# EasyEDA schematic SCH_SmartBluetoothScanner_2022-03-12.json
TITLE: Sheet_1; REV: 1.0; Date: 2022-03-12; Sheet: 1/1; Drawn By: naumanshakir; Company: Your Company
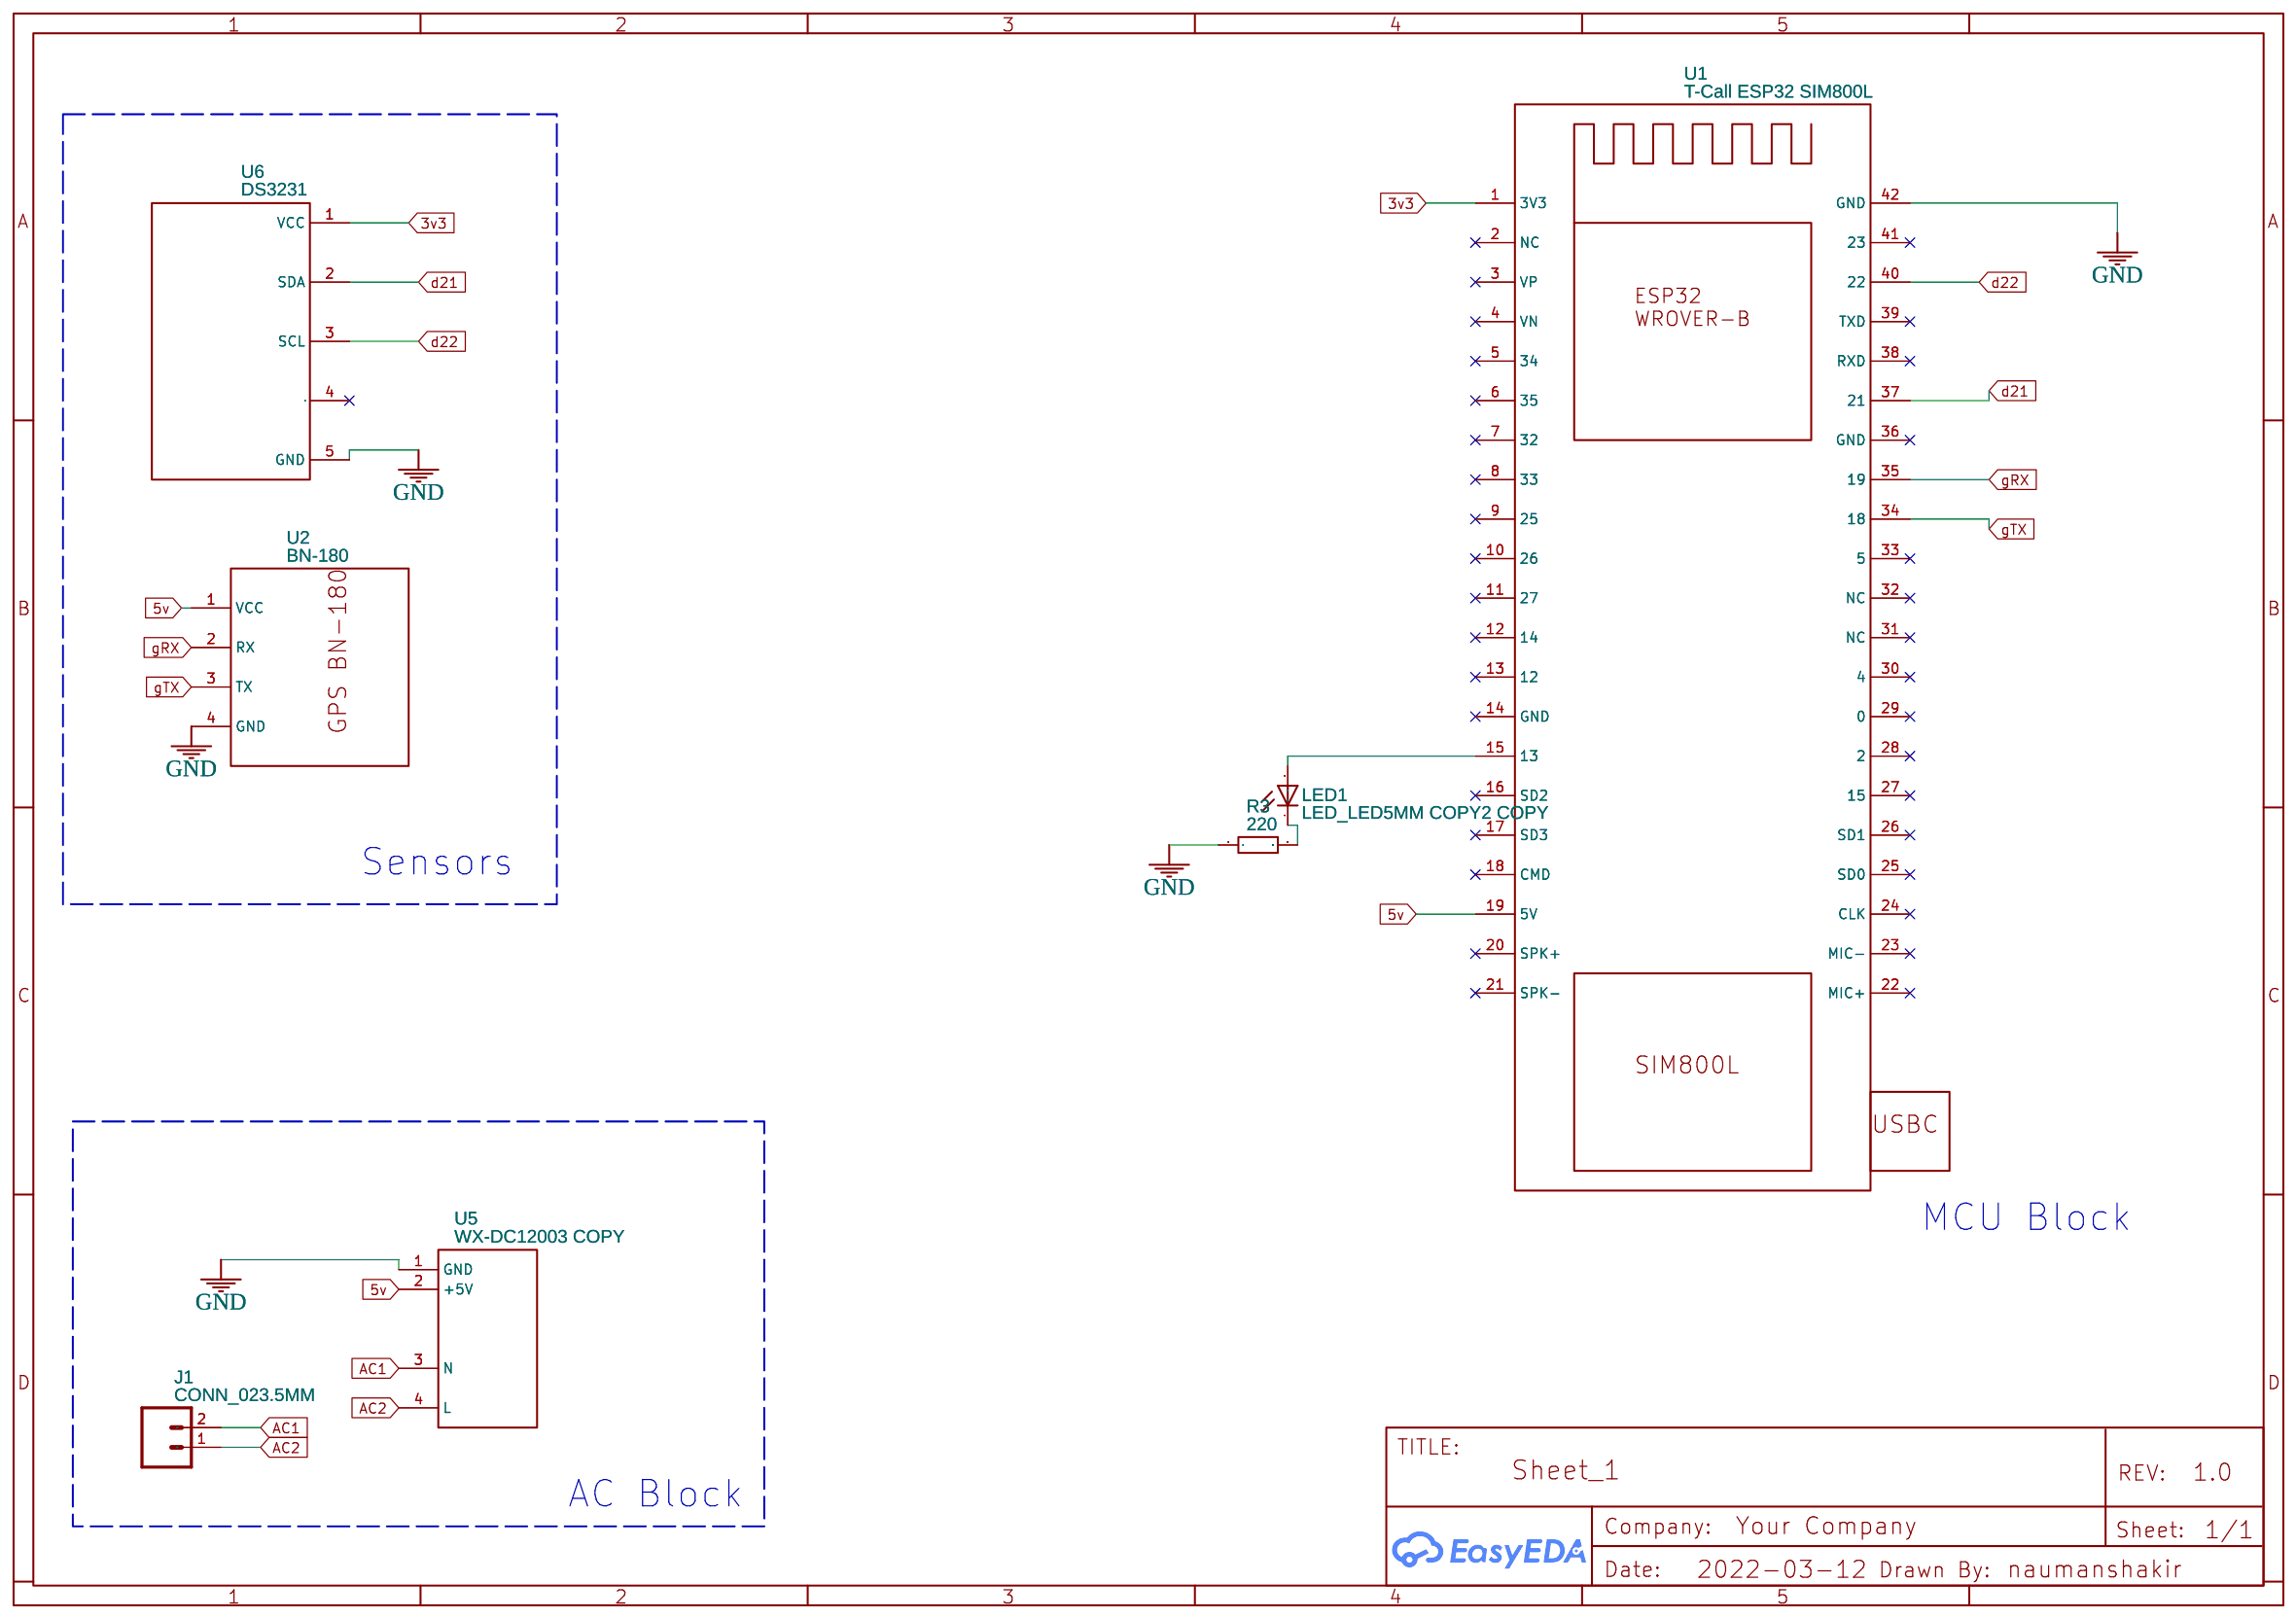
[diagram p0: schematic sheet]

## Parts
J1  CONN_023.5MM  [SCREWTERMINAL-3.5MM-2]
LED1  LED_LED5MM COPY2 COPY  [LED_LED5MM]
R3  220  [RES-TH_BD3.3-L9.0-P13.00-D0.6]
U1  T-Call ESP32 SIM800L  [T-CALL ESP32 SIM800L]
U2  BN-180  [GPS BN-180 BEITIAN]
U5  WX-DC12003 COPY  [WX-DC12003]
U6  DS3231  [DS3231_PI]

## Library data of the parts
J1 = CONN_023.5MM: Contributor: akshay b
LED1 = LED_LED5MM COPY2 COPY: LED
R3 = RD50T5221J: Supplier: LCSC; Supplier Part: C167559; Manufacturer: TA-I Tech; Contributor: LCSC; JLCPCB Part Class: Extended Part; Resistance: 220Ω
U1 = T-Call ESP32 SIM800L: Manufacturer: T-Call; Supplier: LCSC; Supplier Part: ESP32 SIM800L; link: https://raw.githubusercontent.com/Xinyuan-LilyGO/TTGO-T-Call/master/datasheet/T-Call.jpg; Contributor: adntdream
U2 = BN-180: Contributor: RamonRamones
U5 = WX-DC12003 COPY: Contributor: stopka
U6 = DS3231: Manufacturer Part: New SchematicLib; Contributor: rajmqtt

## Nets
3v3: U1.1(3V3) U6.1(VCC)
5v: U1.19(5V) U2.1(VCC) U5.2(+5V)
GND: R3.1 U1.42(GND) U2.4(GND) U5.1(GND) U6.5(GND)
AC1: J1.2 U5.3(N)
AC2: J1.1 U5.4(L)
d21: U1.37(21) U6.2(SDA)
d22: U1.40(22) U6.3(SCL)
gRX: U1.35(19) U2.2(RX)
gTX: U1.34(18) U2.3(TX)
Net-(LED1-A): LED1.A U1.15(13)
Net-(LED1-K): LED1.K(C) R3.2

Not connected (* = marked no-connect by the designer): U1 2(NC)* 3(VP)* 4(VN)* 5(34)* 6(35)* 7(32)* 8(33)* 9(25)* 10(26)* 11(27)* 12(14)* 13(12)* 14(GND)* 16(SD2)* 17(SD3)* 18(CMD)* 20(SPK+)* 21(SPK-)* 22(MIC+)* 23(MIC-)* 24(CLK)* 25(SD0)* 26(SD1)* 27(15)* 28(2)* 29(0)* 30(4)* 31(NC)* 32(NC)* 33(5)* 36(GND)* 38(RXD)* 39(TXD)* 41(23)*; U6 4*

## Notes on the sheet
- Sensors
- MCU Block
- AC Block
